# EAGLE schematic Digitalteil_AVR (EAGLE 4.15)
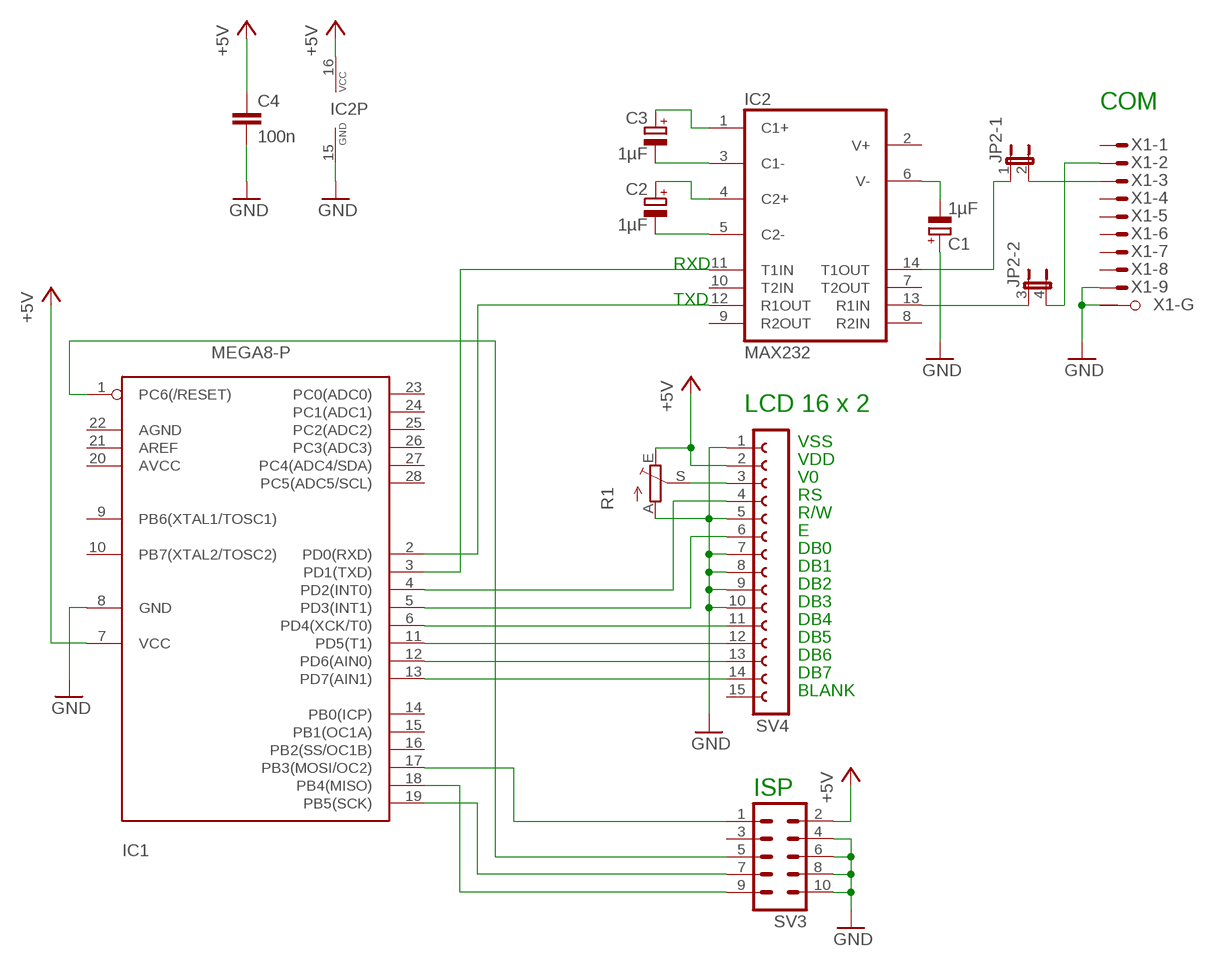
[diagram p0: schematic, sheet 1]

## Parts
C1  1µF  CPOL-EUE2.5-5  [E2,5-5]
C2  1µF  CPOL-EUE2.5-5  [E2,5-5]
C3  1µF  CPOL-EUE2.5-5  [E2,5-5]
C4  100n  C-EU025-030X050  [C025-030X050]
IC1  MEGA8-P  [DIL28-3]
IC2  MAX232  [DIL16]
JP2  JP2QE  [JP2Q]
R1  TRIM_EU-LI10  [LI10]
SV3  ML10  [ML10]
SV4  FE15-1  [FE15]
X1  M09HPS  [M09HP]

## Nets
+5V: C4.1 IC1.7(VCC) IC2.16(VCC) R1.E SV3.2 SV4.2
GND: C1.+ C4.2 IC1.8(GND) IC2.15(GND) R1.A SV3.4 SV3.6 SV3.8 SV3.10 SV4.1 SV4.5 SV4.7 SV4.8 SV4.9 SV4.10 X1.9(-9:M) X1.G1(-G:G1)
N$1: R1.S SV4.3
N$2: IC2.13(R1IN) JP2.3
N$3: IC1.1(PC6(/RESET)) SV3.5
N$4: IC1.19(PB5(SCK)) SV3.7
N$5: IC1.18(PB4(MISO)) SV3.9
N$6: IC1.4(PD2(INT0)) SV4.4
N$7: IC1.5(PD3(INT1)) SV4.6
N$8: IC1.13(PD7(AIN1)) SV4.14
N$9: IC1.12(PD6(AIN0)) SV4.13
N$10: IC1.11(PD5(T1)) SV4.12
N$11: JP2.2 X1.3(-3:M)
N$12: IC2.14(T1OUT) JP2.1
N$13: JP2.4 X1.2(-2:M)
N$15: C3.- IC2.3(C1-)
N$16: C1.- IC2.6(V-)
N$17: C3.+ IC2.1(C1+)
N$18: C2.- IC2.5(C2-)
N$19: C2.+ IC2.4(C2+)
N$21: IC1.2(PD0(RXD)) IC2.12(R1OUT)
N$22: IC1.6(PD4(XCK/T0)) SV4.11
N$23: IC1.17(PB3(MOSI/OC2)) SV3.1
TXD: IC1.3(PD1(TXD)) IC2.11(T1IN)
Unconnected: IC1.9(PB6(XTAL1/TOSC1)) IC1.10(PB7(XTAL2/TOSC2)) IC1.14(PB0(ICP)) IC1.15(PB1(OC1A)) IC1.16(PB2(SS/OC1B)) IC1.20(AVCC) IC1.21(AREF) IC1.22(AGND) IC1.23(PC0(ADC0)) IC1.24(PC1(ADC1)) IC1.25(PC2(ADC2)) IC1.26(PC3(ADC3)) IC1.27(PC4(ADC4/SDA)) IC1.28(PC5(ADC5/SCL)) IC2.2(V+) IC2.7(T2OUT) IC2.8(R2IN) IC2.9(R2OUT) IC2.10(T2IN) SV3.3 SV4.15 X1.1(-1:M) X1.4(-4:M) X1.5(-5:M) X1.6(-6:M) X1.7(-7:M) X1.8(-8:M) X1.G2(-G:G2)

## Notes on the sheet
- COM
- RXD
- TXD
- LCD 16 x 2
- VSS
- VDD
- V0
- RS
- R/W
- E
- DB0
- DB1
- DB2
- DB3
- DB4
- DB5
- DB6
- DB7
- BLANK
- ISP

## Library data of the parts
C1-C3 = rcl:CPOL-EU: POLARIZED CAPACITOR, European symbol
C4 = rcl:C-EU: CAPACITOR, European symbol
IC1 = atmel2:MEGA8-P: MICROCONTROLLER 8 Kbytes FLASH 1 kbytes SRAM 512 bytes EEPROM USART 4-channel 10 bit ADC 2-channel 8 bit ADC
IC2 = maxim:MAX232: RS232 TRANSEIVER
JP2 = jumper:JP2QE: JUMPER
R1 = pot:TRIM_EU-: POTENTIOMETER
SV3 = con-harting-ml:ML10: HARTING
SV4 = con-lsta:FE15-1: FEMALE HEADER
X1 = con-subd:M09HPS: SUB-D